# Altium schematic sheet APP_1_DDR3_m.SchDoc
size Tabloid; SheetNumber: 6; SheetTotal: 16; Sheet_Name: DDR3_m; Size: 11x17
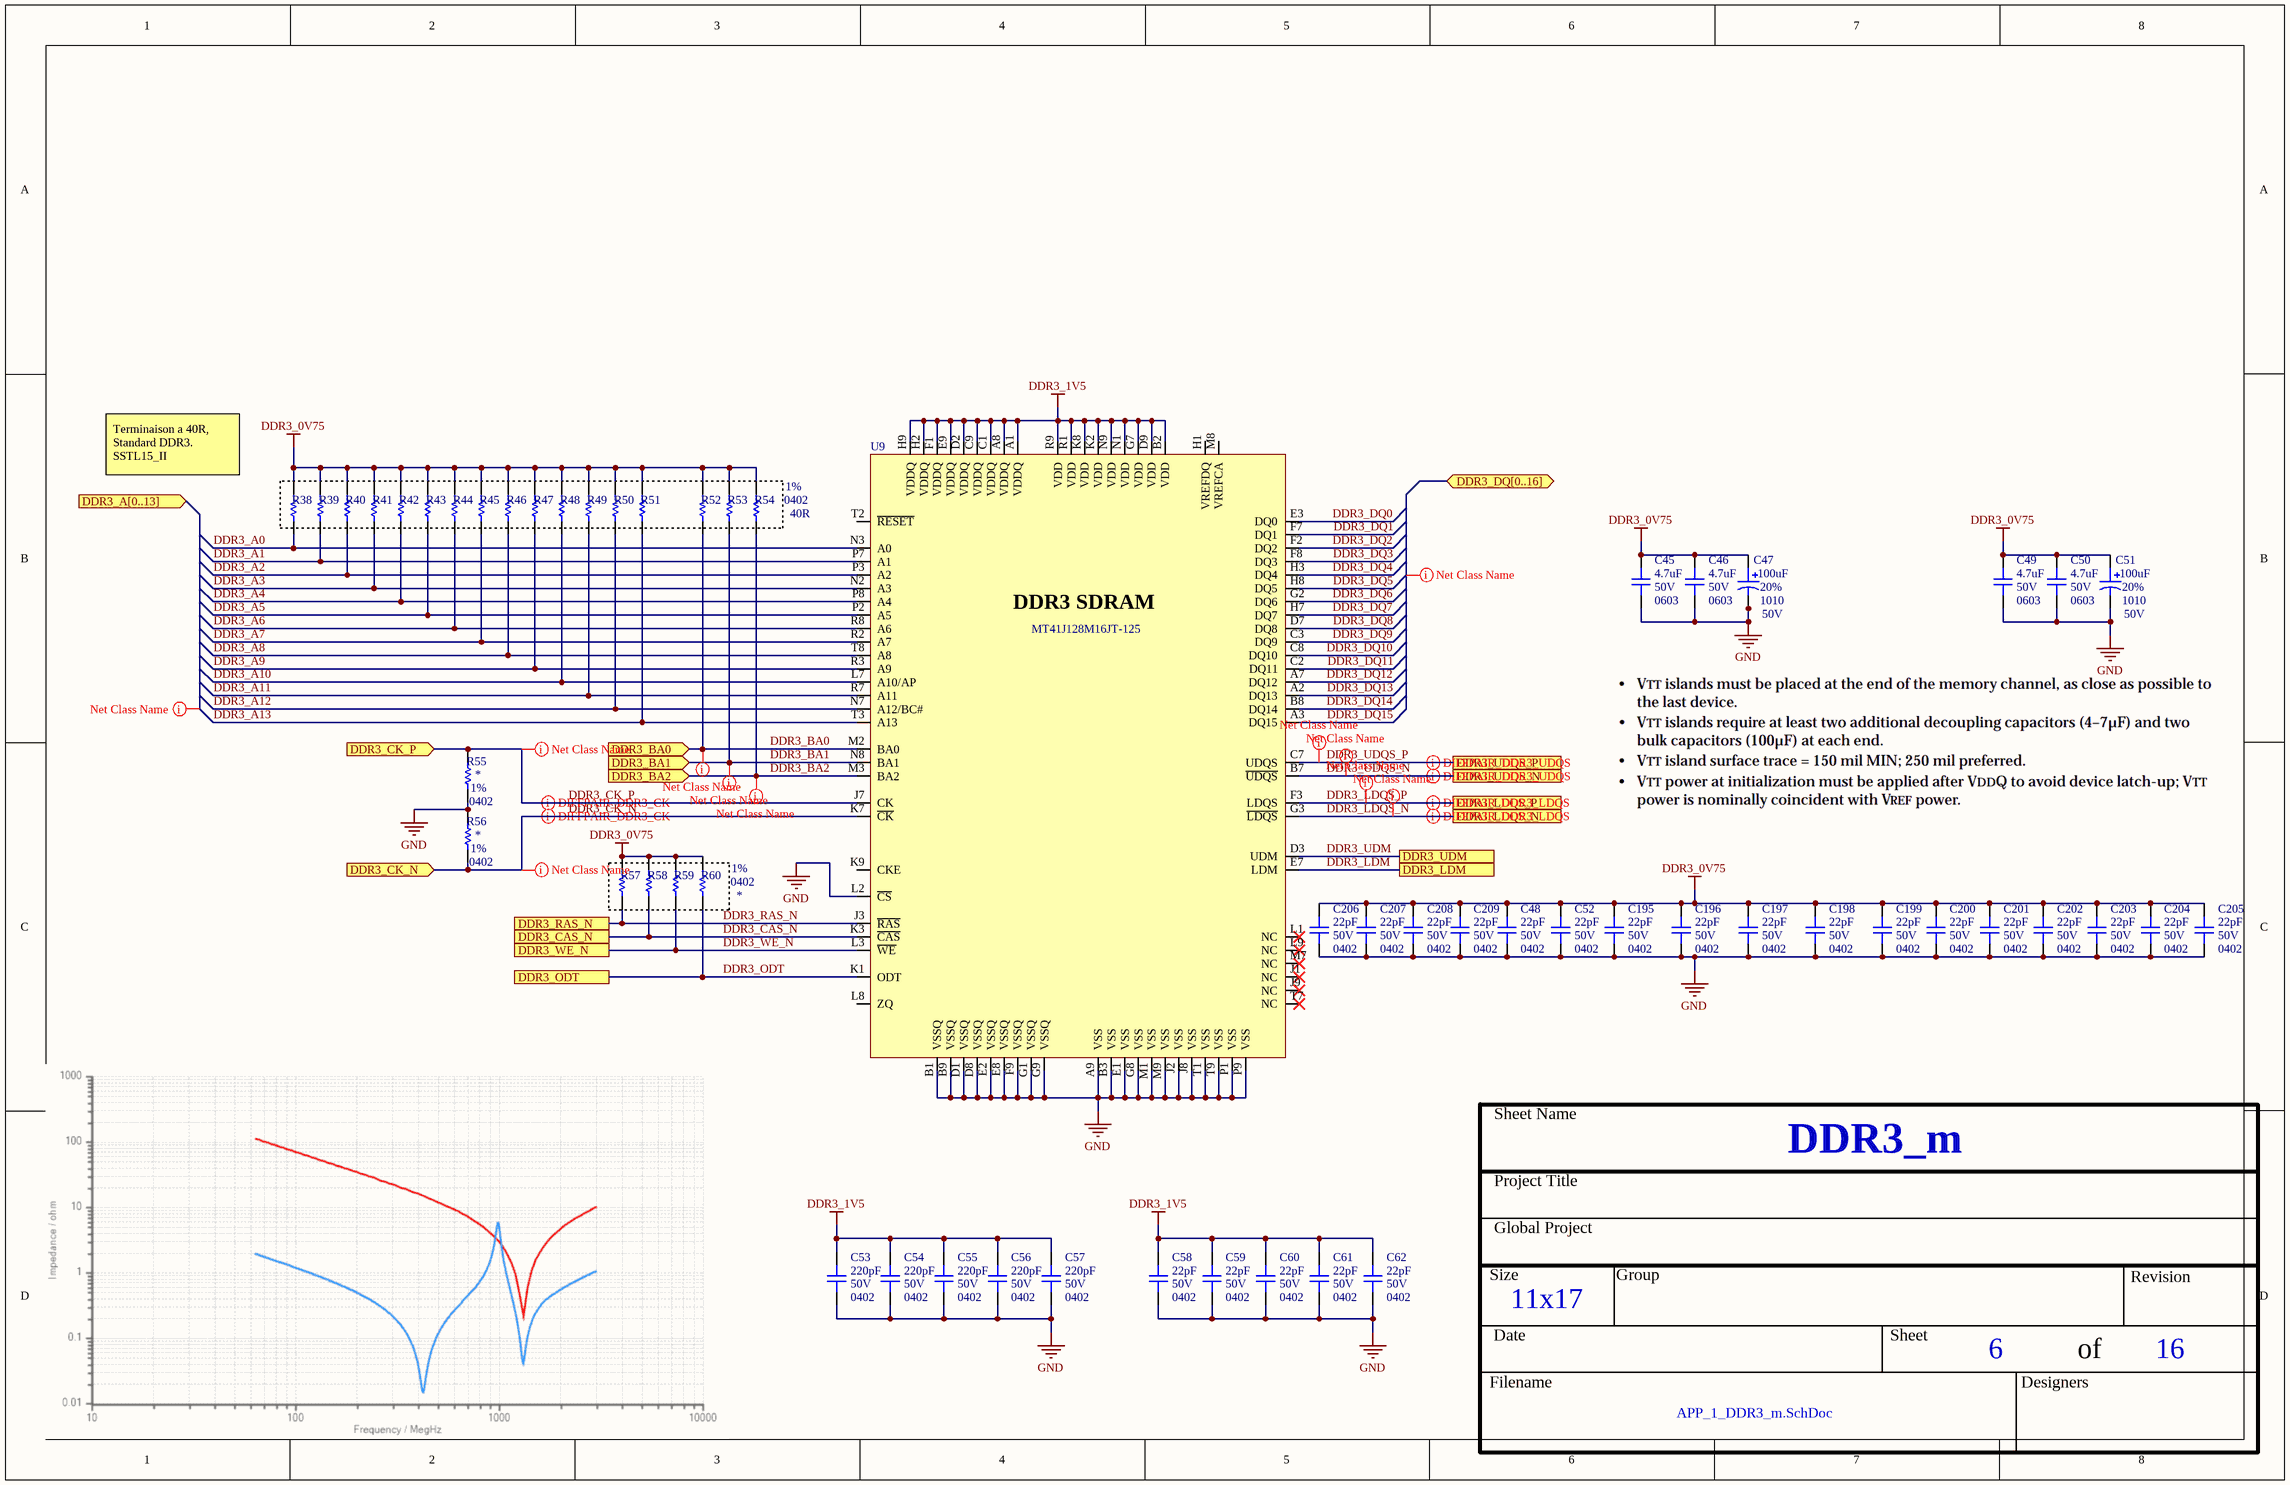
[diagram p0: APP_1_DDR3_m.SchDoc]

## Parts
C45  value 4.7uF  Voltage: 50V  Package: 0603  [CAP_0603]  (hidden comment: CAP - 0603)
C46  value 4.7uF  Voltage: 50V  Package: 0603  [CAP_0603]  (hidden comment: CAP - 0603)
C47  value 100uF  Voltage: 50V  Package: 1010  Precision: 20%  [CAP_ALU_1010_vishay]  (hidden comment: MAL215099101E3)
C48  value 22pF  Voltage: 50V  Package: 0402  [CAP_0402]  (hidden comment: CAP - 0402)
C49  value 4.7uF  Voltage: 50V  Package: 0603  [CAP_0603]  (hidden comment: CAP - 0603)
C50  value 4.7uF  Voltage: 50V  Package: 0603  [CAP_0603]  (hidden comment: CAP - 0603)
C51  value 100uF  Voltage: 50V  Package: 1010  Precision: 20%  [CAP_ALU_1010_vishay]  (hidden comment: MAL215099101E3)
C52  value 22pF  Voltage: 50V  Package: 0402  [CAP_0402]  (hidden comment: CAP - 0402)
C53  value 220pF  Voltage: 50V  Package: 0402  [CAP_0402]  (hidden comment: CAP - 0402)
C54  value 220pF  Voltage: 50V  Package: 0402  [CAP_0402]  (hidden comment: CAP - 0402)
C55  value 220pF  Voltage: 50V  Package: 0402  [CAP_0402]  (hidden comment: CAP - 0402)
C56  value 220pF  Voltage: 50V  Package: 0402  [CAP_0402]  (hidden comment: CAP - 0402)
C57  value 220pF  Voltage: 50V  Package: 0402  [CAP_0402]  (hidden comment: CAP - 0402)
C58  value 22pF  Voltage: 50V  Package: 0402  [CAP_0402]  (hidden comment: CAP - 0402)
C59  value 22pF  Voltage: 50V  Package: 0402  [CAP_0402]  (hidden comment: CAP - 0402)
C60  value 22pF  Voltage: 50V  Package: 0402  [CAP_0402]  (hidden comment: CAP - 0402)
C61  value 22pF  Voltage: 50V  Package: 0402  [CAP_0402]  (hidden comment: CAP - 0402)
C62  value 22pF  Voltage: 50V  Package: 0402  [CAP_0402]  (hidden comment: CAP - 0402)
C195  value 22pF  Voltage: 50V  Package: 0402  [CAP_0402]  (hidden comment: CAP - 0402)
C196  value 22pF  Voltage: 50V  Package: 0402  [CAP_0402]  (hidden comment: CAP - 0402)
C197  value 22pF  Voltage: 50V  Package: 0402  [CAP_0402]  (hidden comment: CAP - 0402)
C198  value 22pF  Voltage: 50V  Package: 0402  [CAP_0402]  (hidden comment: CAP - 0402)
C199  value 22pF  Voltage: 50V  Package: 0402  [CAP_0402]  (hidden comment: CAP - 0402)
C200  value 22pF  Voltage: 50V  Package: 0402  [CAP_0402]  (hidden comment: CAP - 0402)
C201  value 22pF  Voltage: 50V  Package: 0402  [CAP_0402]  (hidden comment: CAP - 0402)
C202  value 22pF  Voltage: 50V  Package: 0402  [CAP_0402]  (hidden comment: CAP - 0402)
C203  value 22pF  Voltage: 50V  Package: 0402  [CAP_0402]  (hidden comment: CAP - 0402)
C204  value 22pF  Voltage: 50V  Package: 0402  [CAP_0402]  (hidden comment: CAP - 0402)
C205  value 22pF  Voltage: 50V  Package: 0402  [CAP_0402]  (hidden comment: CAP - 0402)
C206  value 22pF  Voltage: 50V  Package: 0402  [CAP_0402]  (hidden comment: CAP - 0402)
C207  value 22pF  Voltage: 50V  Package: 0402  [CAP_0402]  (hidden comment: CAP - 0402)
C208  value 22pF  Voltage: 50V  Package: 0402  [CAP_0402]  (hidden comment: CAP - 0402)
C209  value 22pF  Voltage: 50V  Package: 0402  [CAP_0402]  (hidden comment: CAP - 0402)
R38  RES - 0402  [RES_0402]  (value not drawn)
R39  RES - 0402  [RES_0402]  (value not drawn)
R40  RES - 0402  [RES_0402]  (value not drawn)
R41  RES - 0402  [RES_0402]  (value not drawn)
R42  RES - 0402  [RES_0402]  (value not drawn)
R43  RES - 0402  [RES_0402]  (value not drawn)
R44  RES - 0402  [RES_0402]  (value not drawn)
R45  RES - 0402  [RES_0402]  (value not drawn)
R46  RES - 0402  [RES_0402]  (value not drawn)
R47  RES - 0402  [RES_0402]  (value not drawn)
R48  RES - 0402  [RES_0402]  (value not drawn)
R49  RES - 0402  [RES_0402]  (value not drawn)
R50  RES - 0402  [RES_0402]  (value not drawn)
R51  RES - 0402  [RES_0402]  (value not drawn)
R52  RES - 0402  [RES_0402]  (value not drawn)
R53  RES - 0402  [RES_0402]  (value not drawn)
R54  value 40R  Package: 0402  Precision: 1%  [RES_0402]  (hidden comment: RES - 0402)
R55  Package: 0402  Precision: 1%  [RES_0402]  (hidden comment: RES - 0402)
R56  Package: 0402  Precision: 1%  [RES_0402]  (hidden comment: RES - 0402)
R57  RES - 0402  [RES_0402]  (value not drawn)
R58  RES - 0402  [RES_0402]  (value not drawn)
R59  RES - 0402  [RES_0402]  (value not drawn)
R60  Package: 0402  Precision: 1%  [RES_0402]  (hidden comment: RES - 0402)
U9  MT41J128M16JT-125  [MEM_DDR3_MT41J128M16JT-125]

## Ports
DDR3_A[0..13] (in, see APP_1_FPGA_m[3B]), DDR3_BA0 (in, see APP_1_FPGA_m[3B]), DDR3_BA1 (in, see APP_1_FPGA_m[3B]), DDR3_BA2 (in, see APP_1_FPGA_m[3B]), DDR3_CAS_N (see APP_1_FPGA_m[3B]), DDR3_CK_N (in, see APP_1_FPGA_m[3B]), DDR3_CK_P (in, see APP_1_FPGA_m[3B]), DDR3_DQ[0..16] (bidir, see APP_1_FPGA_m[3A]), DDR3_LDM, DDR3_LDQS_N, DDR3_LDQS_P, DDR3_ODT (see APP_1_FPGA_m[3B]), DDR3_RAS_N (see APP_1_FPGA_m[3B]), DDR3_UDM (see APP_1_FPGA_m[3B]), DDR3_UDQS_N (see APP_1_FPGA_m[3A]), DDR3_UDQS_P (see APP_1_FPGA_m[3A]), DDR3_WE_N (see APP_1_FPGA_m[3B])

## Nets
DDR3_0V75: C45.2 C46.2 C47.1 C48.2 C49.2 C50.2 C51.1 C52.2 C195.2 C196.2 C197.2 C198.2 C199.2 C200.2 C201.2 C202.2 C203.2 C204.2 C205.2 C206.2 C207.2 C208.2 C209.2 R38.2 R39.2 R40.2 R41.2 R42.2 R43.2 R44.2 R45.2 R46.2 R47.2 R48.2 R49.2 R50.2 R51.2 R52.2 R53.2 R54.2 R57.2 R58.2 R59.2 R60.2
DDR3_1V5: C53.2 C54.2 C55.2 C56.2 C57.2 C58.2 C59.2 C60.2 C61.2 C62.2 U9.A1(VDDQ) U9.A8(VDDQ) U9.B2(VDD) U9.C1(VDDQ) U9.C9(VDDQ) U9.D2(VDDQ) U9.D9(VDD) U9.E9(VDDQ) U9.F1(VDDQ) U9.G7(VDD) U9.H2(VDDQ) U9.H9(VDDQ) U9.K2(VDD) U9.K8(VDD) U9.N1(VDD) U9.N9(VDD) U9.R1(VDD) U9.R9(VDD)
GND: C45.1 C46.1 C47.2 C48.1 C49.1 C50.1 C51.2 C52.1 C53.1 C54.1 C55.1 C56.1 C57.1 C58.1 C59.1 C60.1 C61.1 C62.1 C195.1 C196.1 C197.1 C198.1 C199.1 C200.1 C201.1 C202.1 C203.1 C204.1 C205.1 C206.1 C207.1 C208.1 C209.1 R55.1 R56.2 U9.A9(VSS) U9.B1(VSSQ) U9.B3(VSS) U9.B9(VSSQ) U9.D1(VSSQ) U9.D8(VSSQ) U9.E1(VSS) U9.E2(VSSQ) U9.E8(VSSQ) U9.F9(VSSQ) U9.G1(VSSQ) U9.G8(VSS) U9.G9(VSSQ) U9.J2(VSS) U9.J8(VSS) U9.L2(~{CS}) U9.M1(VSS) U9.M9(VSS) U9.P1(VSS) U9.P9(VSS) U9.T1(VSS) U9.T9(VSS)
DDR3_A0: R38.1 U9.N3(A0)
DDR3_A1: R39.1 U9.P7(A1)
DDR3_A2: R40.1 U9.P3(A2)
DDR3_A3: R41.1 U9.N2(A3)
DDR3_A4: R42.1 U9.P8(A4)
DDR3_A5: R43.1 U9.P2(A5)
DDR3_A6: R44.1 U9.R8(A6)
DDR3_A7: R45.1 U9.R2(A7)
DDR3_A8: R46.1 U9.T8(A8)
DDR3_A9: R47.1 U9.R3(A9)
DDR3_A10: R48.1 U9.L7(A10/AP)
DDR3_A11: R49.1 U9.R7(A11)
DDR3_A12: R50.1 U9.N7(A12/BC#)
DDR3_A13: R51.1 U9.T3(A13)
DDR3_BA0: R52.1 U9.M2(BA0) ; port DDR3_BA0
DDR3_BA1: R53.1 U9.N8(BA1) ; port DDR3_BA1
DDR3_BA2: R54.1 U9.M3(BA2) ; port DDR3_BA2
DDR3_CAS_N: R58.1 U9.K3(~{CAS}) ; port DDR3_CAS_N
DDR3_CK_N: R56.1 U9.K7(~{CK}) ; port DDR3_CK_N
DDR3_CK_P: R55.2 U9.J7(CK) ; port DDR3_CK_P
DDR3_DQ0: U9.E3(DQ0)
DDR3_DQ1: U9.F7(DQ1)
DDR3_DQ2: U9.F2(DQ2)
DDR3_DQ3: U9.F8(DQ3)
DDR3_DQ4: U9.H3(DQ4)
DDR3_DQ5: U9.H8(DQ5)
DDR3_DQ6: U9.G2(DQ6)
DDR3_DQ7: U9.H7(DQ7)
DDR3_DQ8: U9.D7(DQ8)
DDR3_DQ9: U9.C3(DQ9)
DDR3_DQ10: U9.C8(DQ10)
DDR3_DQ11: U9.C2(DQ11)
DDR3_DQ12: U9.A7(DQ12)
DDR3_DQ13: U9.A2(DQ13)
DDR3_DQ14: U9.B8(DQ14)
DDR3_DQ15: U9.A3(DQ15)
DDR3_LDM: U9.E7(LDM) ; port DDR3_LDM
DDR3_LDQS_N: U9.G3(~{LDQS}) ; port DDR3_LDQS_N
DDR3_LDQS_P: U9.F3(LDQS) ; port DDR3_LDQS_P
DDR3_ODT: R60.1 U9.K1(ODT) ; port DDR3_ODT
DDR3_RAS_N: R57.1 U9.J3(~{RAS}) ; port DDR3_RAS_N
DDR3_UDM: U9.D3(UDM) ; port DDR3_UDM
DDR3_UDQS_N: U9.B7(~{UDQS}) ; port DDR3_UDQS_N
DDR3_UDQS_P: U9.C7(UDQS) ; port DDR3_UDQS_P
DDR3_WE_N: R59.1 U9.L3(~{WE}) ; port DDR3_WE_N

Not connected (* = marked no-connect by the designer): U9 H1(VREFDQ) J1(NC)* J9(NC)* K9(CKE) L1(NC)* L8(ZQ) L9(NC)* M7(NC)* M8(VREFCA) T2(~{RESET}) T7(NC)*

## Layout directives
differential pair: DDR3_CK_N, DDR3_CK_P, DDR3_LDQS_N, DDR3_LDQS_P, DDR3_UDQS_N, DDR3_UDQS_P
net class DDR3_A[0..13]: (no net found under the mark)
net class DDR3_BA: DDR3_BA0, DDR3_BA1, DDR3_BA2
net class DDR3_DQ[0..16]: (no net found under the mark)
net class DDR3_CLK: DDR3_CK_N, DDR3_CK_P, DDR3_LDQS_N, DDR3_LDQS_P, DDR3_UDQS_N, DDR3_UDQS_P

## Notes on the sheet
- Terminaison a 40R, Standard DDR3. SSTL15_II
- Sheet Name
- Project Title
- Global Project
- Size
- Group
- Revision
- Date
- Sheet
- of
- Filename
- Designers
- (in symbol MEM_DDR3_MT41J128M16JT-125:K TR) DDR3 SDRAM

## Library data of the parts
C45 C46 C49 C50 = CAP - 0603: Precision: 10%; Current: *; CreatedBy: Jonathan Bouchard; Power: *
C47 C51 = CAP_ALU_MAL215099101E3: CAP - ALU 100uF 20% 50V - 1010; Current: 490mA; Mfg: Vishay Dale; Mfg Part Number: MAL215099101E3; HelpURL: http://www.vishay.com/docs/28395/150crz.pdf; CreatedBy: Jonathan Bouchard; Temperature: -55°C to 125°C; Power: *; Supplier 1: Digikey; Supplier Part Number 1: 4399PHDKR-ND
C48 C52-C62 C195-C209 = CAP - 0402: Precision: 10%; Current: *; CreatedBy: Jonathan Bouchard; Power: *
R38-R53 R57-R59 = RES - 0402: Voltage: 50V; Power: 1/16W; Precision: 1%; Current: *; CreatedBy: Jonathan Bouchard; Package: 0402; Value: *
R54-R56 R60 = RES - 0402: Voltage: 50V; Power: 1/16W; Current: *; CreatedBy: Jonathan Bouchard
  R55 R56 R60: Value: *
U9 = MEM_DDR3_MT41J128M16JT-125:K TR: MEM - DDR3 SDRAM 2GBIT 800MHZ - TFBGA-96; Voltage: 1.425 V ~ 1.575 V; Mfg: Micrel; Current: *; Power: *; Mfg Part Number: MT41J128M16JT-125; HelpURL: http://www.micron.com/~/media/Documents/Products/Data%20Sheet/DRAM/DDR3/2Gb_DDR3_SDRAM.pdf; CreatedBy: Jonathan Bouchard; Temperature: 0°C ~ 95°C (TC); Value: *; Precision: *; Package: TFBGA-96; Supplier 1: Digikey; Supplier Part Number 1: 557-1611-1-ND